# Altium schematic sheet Power.SchDoc: =ProjectName
size A4; CheckedBy: DatNB; Author: Ven; CompanyName: Nacentech; Organization: IMET
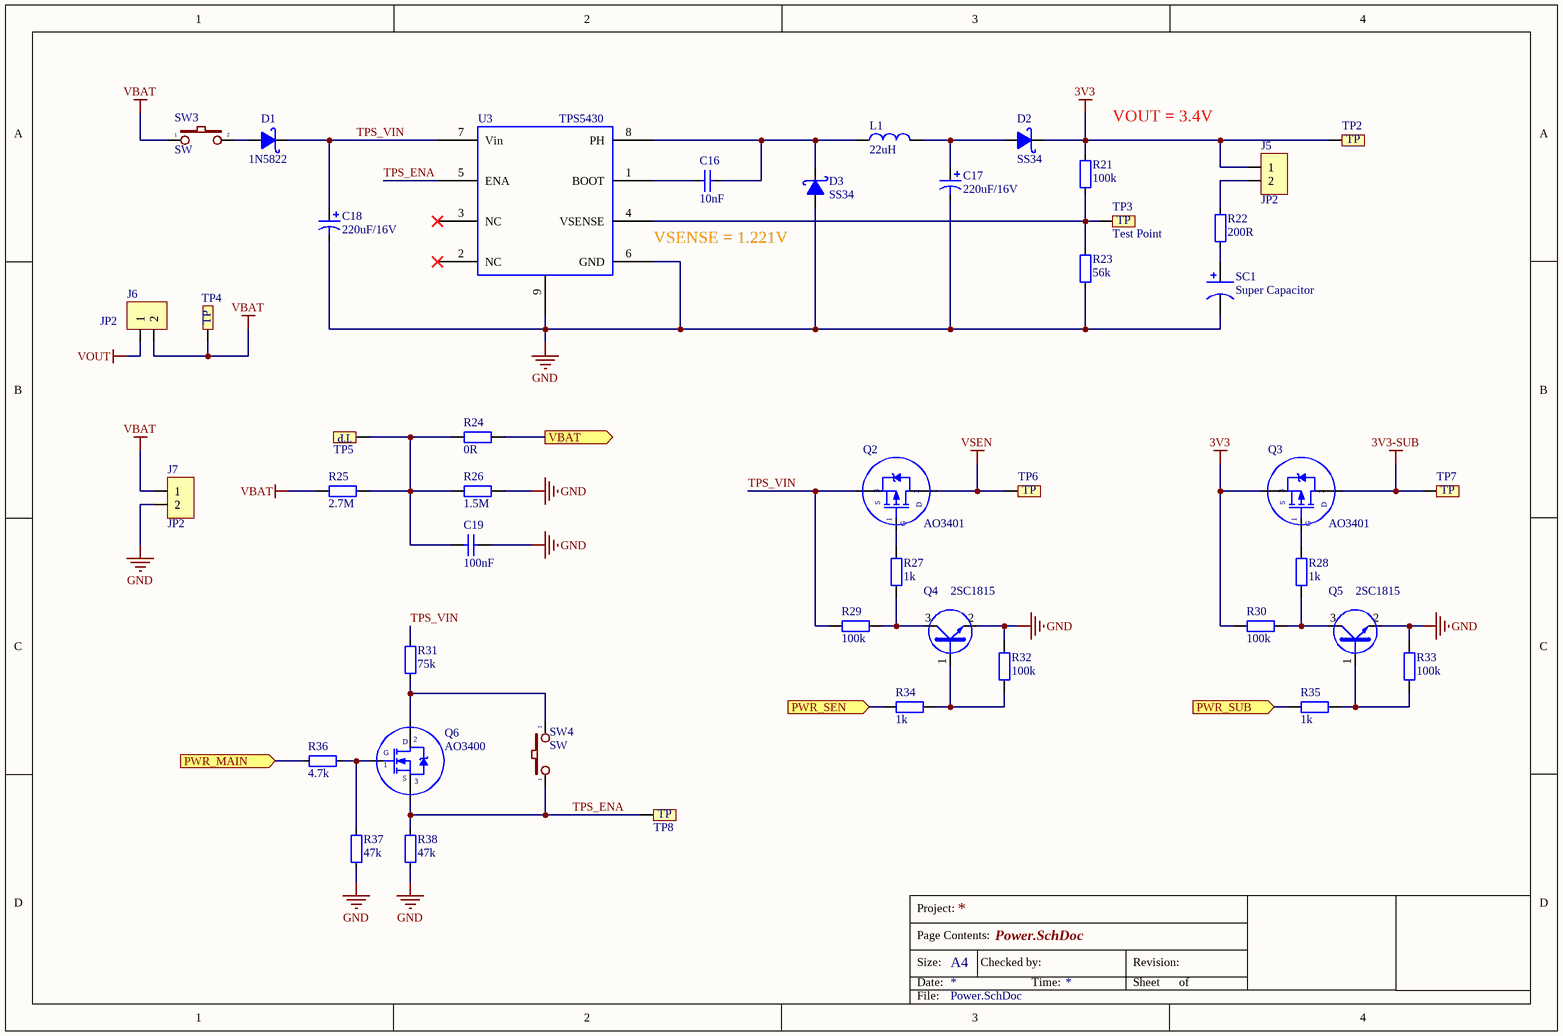
[diagram p0: Power.SchDoc]

## Parts
C16  10nF  [CAP_0805]
C17  220uF/16V  [C8mm]
C18  220uF/16V  [C8mm]
C19  100nF  [CAP_0805]
D1  1N5822  [DIO-214AC(SMA)]
D2  SS34  [DO-214AC(SMA)]
D3  SS34  [DO-214AC(SMA)]
J5  JP2  [JP2-CLOSED]
J6  JP2  [JP2-CLOSED]
J7  JP2  [CON2]
L1  22uH  [L-SMD-M-7.3x4.5]
Q2  AO3401  [SOT23A]
Q3  AO3401  [SOT23A]
Q4  2SC1815  [SOT23D]
Q5  2SC1815  [SOT23D]
Q6  AO3400  [SOT23A]
R21  100k  [RES-SMD-0805]
R22  200R  [RES-SMD-0805]
R23  56k  [RES-SMD-0805]
R24  0R  [RES-SMD-0805]
R25  2.7M  [RES-SMD-0805]
R26  1.5M  [RES-SMD-0805]
R27  1k  [RES-SMD-0805]
R28  1k  [RES-SMD-0805]
R29  100k  [RES-SMD-0805]
R30  100k  [RES-SMD-0805]
R31  75k  [RES-SMD-0805]
R32  100k  [RES-SMD-0805]
R33  100k  [RES-SMD-0805]
R34  1k  [RES-SMD-0805]
R35  1k  [RES-SMD-0805]
R36  4.7k  [RES-SMD-0805]
R37  47k  [RES-SMD-0805]
R38  47k  [RES-SMD-0805]
SC1  Super Capacitor  [SUPERCAPHC]
SW3  SW  [SW102_SIDE]
SW4  SW  [SW 3x2x4]
TP2  Test Point  [TP_SMD]  (value not drawn)
TP3  Test Point  [TP_SMD]
TP4  Test Point  [TP_SMD]  (value not drawn)
TP5  Test Point  [TP_SMD]  (value not drawn)
TP6  Test Point  [TP_SMD]  (value not drawn)
TP7  Test Point  [TP_SMD]  (value not drawn)
TP8  Test Point  [TP_SMD]  (value not drawn)
U3  TPS5430  [TPS5430-2]

## Ports
PWR_MAIN (in), PWR_SEN (in), PWR_SUB (in), VBAT (out)

## Nets
3V3: D2.2(K) J5.1 Q3.3(S) R21.2 R30.1 TP2.1
3V3-SUB: Q3.2(D) TP7.1
GND: C17.2 C18.2 C19.1 D3.1(A) J7.2 Q4.2(E) Q5.2(E) R23.1 R26.1 R32.2 R33.2 R37.1 R38.1 SC1.2 U3.6(GND) U3.9(PWR_PAD)
VBAT: J6.2 J7.1 R25.2 SW3.1 TP4.1
VOUT: J6.1
VSEN: Q2.2(D) TP6.1
PWR_MAIN: R36.2 ; port PWR_MAIN
PWR_SEN: R34.2 ; port PWR_SEN
PWR_SUB: R35.2 ; port PWR_SUB
TPS_ENA: Q6.3(S) R38.2 SW4.1 TP8.1 U3.5(ENA)
TPS_VIN: C18.1 D1.2(K) Q2.3(S) R29.1 R31.2 U3.7(Vin)
VBAT: R24.1 ; port VBAT  [a separate net that carries the same name]
NetC16_1: C16.1 D3.2(K) L1.1 U3.8(PH)
NetC16_2: C16.2 U3.1(BOOT)
NetC17_1: C17.1 D2.1(A) L1.2
NetC19_2: C19.2 R24.2 R25.1 R26.2 TP5.1
NetD1_1: D1.1(A) SW3.2
NetJ5_2: J5.2 R22.2
NetQ2_1: Q2.1(G) R27.2
NetQ3_1: Q3.1(G) R28.2
NetQ4_1: Q4.1(B) R32.1 R34.1
NetQ4_3: Q4.3(C) R27.1 R29.2
NetQ5_1: Q5.1(B) R33.1 R35.1
NetQ5_3: Q5.3(C) R28.1 R30.2
NetQ6_1: Q6.1(G) R36.1 R37.2
NetQ6_2: Q6.2(D) R31.1 SW4.2
NetR21_1: R21.1 R23.2 TP3.1 U3.4(VSENSE)
NetR22_1: R22.1 SC1.1

Not connected (* = marked no-connect by the designer): U3 2(NC)* 3(NC)*

## Notes on the sheet
- VOUT = 3.4V
- VSENSE = 1.221V
- Project:
- Page Contents:
- Size:
- Date:
- A4
- Checked by:
- Time:
- Revision:
- Sheet
- of
- File:

## Library data of the parts
C16 C19 = CapSMD: Capacitor; Value: 33p; Published: 8-Jun-2000; LatestRevisionDate: 17-Jul-2002; LatestRevisionNote: Re-released for DXP Platform.; PackageReference: RAD-0.3; Publisher: Altium Limited
C17 C18 = Cap Pol: Polarized Capacitor (Axial); Published: 8-Jun-2000; LatestRevisionDate: 17-Jul-2002; LatestRevisionNote: Re-released for DXP Platform.; PackageReference: POLAR0.8; Publisher: Altium Limited
D1 = 1N5822: Schottky Rectifiers; Value: Diode c?m 1N5408
D2 D3 = Diode Schottky: Diode Schottky SS34
J5-J7 = JP2: WR-PHD 2.54 mm Angled Socket Header; Manufacturer: W¨¹rth Elektronik eiSos GmbH; partNo: 613002143121; ComponentLink1 Description: Manufacturer; ComponentLink2 Description: Datasheet; NoPins: 02; Created Date: 29 March 2013; ComponentLink1URL: http://www.we-online.com; ComponentLink2URL: http://katalog.we-online.de/em/datasheet/6130xx143121.pdf; Created by: Karrer Zheng
L1 = Inductor: Value: 150 mH
Q2 Q3 = MOSFET_P: 30V 5.8A P-Channel MOSFET
Q4 Q5 = C1815: NPN 600mW, ECB; Value: C1815
Q6 = MOSFET_N: Generic N Channel MOSFET
R21-R23 R31 R36-R38 = Resistor - SMD: Resistor; Manufacturer: Generic Components; Class: Passive; Published: 08/06/2000; Publisher: Altium Hobart Technology Centre
R24-R30 R32-R35 = Resistor - SMD: Resistor SMD; Manufacturer: Generic Components; Class: Passive; Published: 08/06/2000; Publisher: Altium Hobart Technology Centre
SC1 = SuperCap
SW3 SW4 = SW2: Switch button 2 pin; Value: SW chip 2 pin
TP2-TP8 = TP: CONNECT 1
U3 = TPS5430: Name: TPS5430